# EasyEDA schematic SCH_IRRemote.json
TITLE: Sheet_1; REV: 1.0; Date: 2022-01-18; Sheet: 1/1; Drawn By: lingex; Company: Your Company
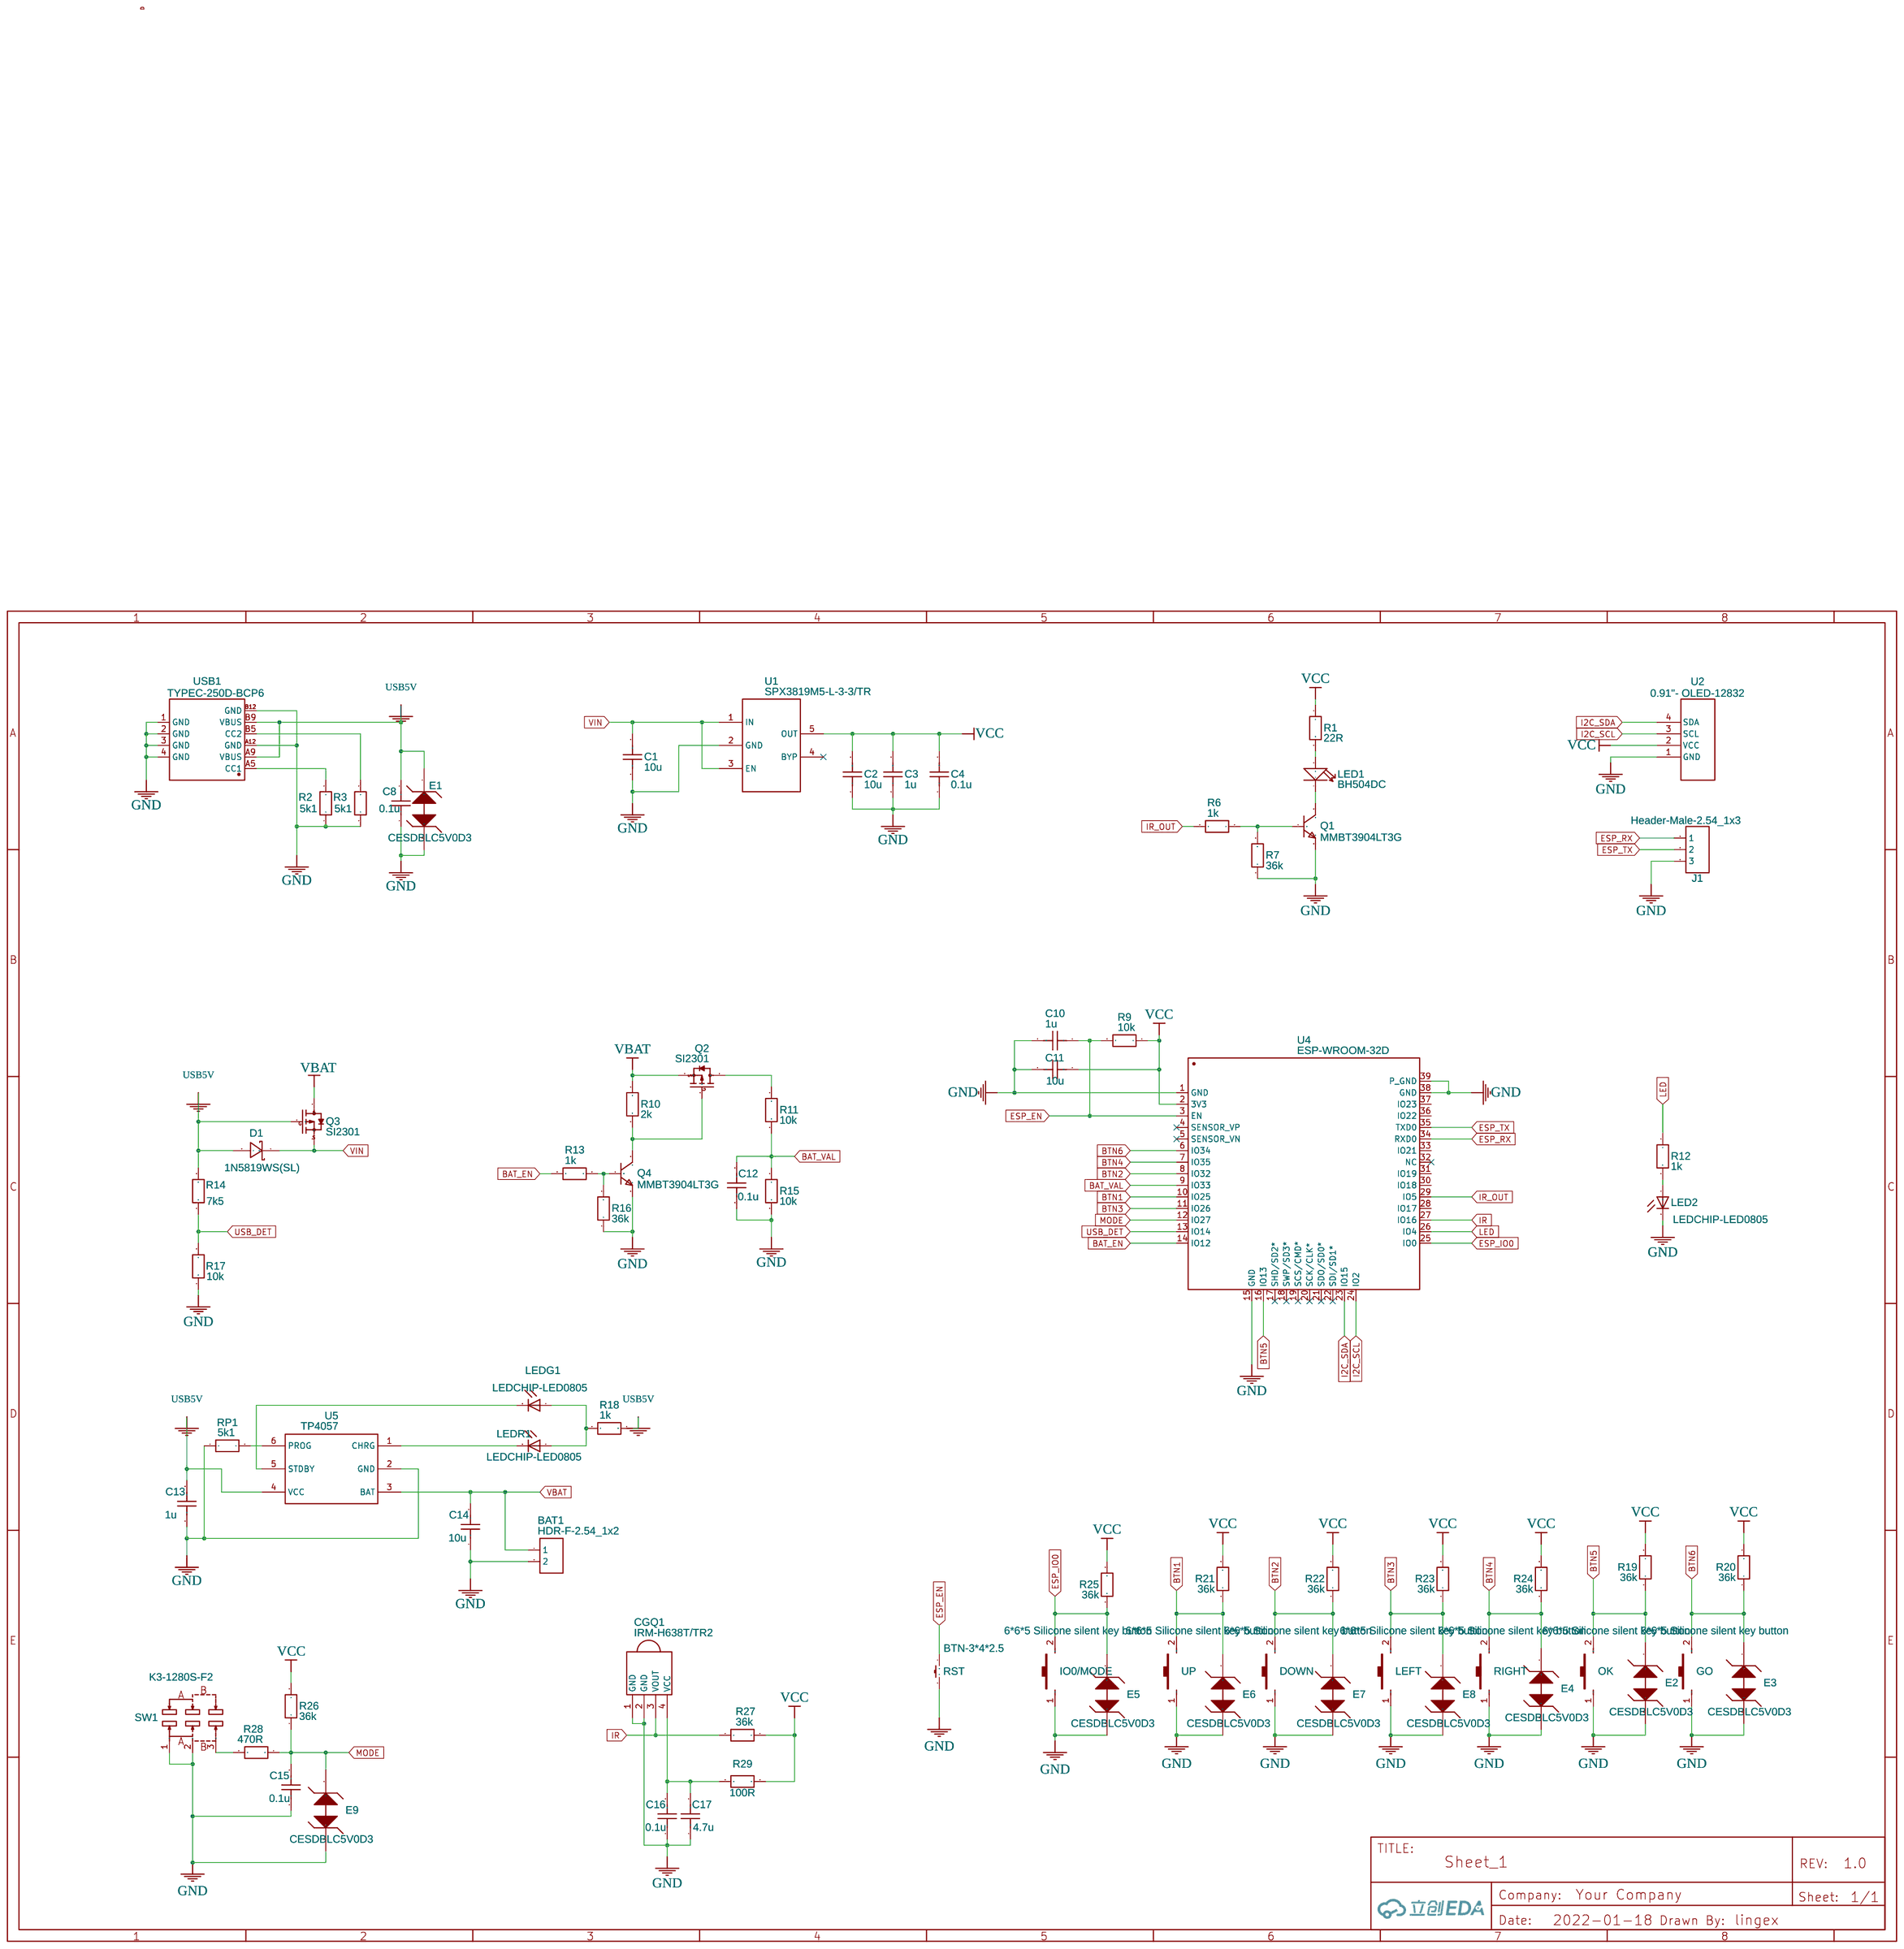
[diagram p0: schematic sheet]

## Parts
BAT1  HDR-F-2.54_1x2  [HDR-TH_2P-P2.54-V]
C1  10u  [C0603]
C2  10u  [C0603]
C3  1u  [C0603]
C4  0.1u  [C0603]
C8  0.1u  [C0603]
C10  1u  [C0603]
C11  10u  [C0603]
C12  0.1u  [C0603]
C13  1u  [C0805]
C14  10u  [C0805]
C15  0.1u  [C0603]
C16  0.1u  [C0603]
C17  4.7u  [C0603]
CGQ1  IRM-H638T/TR2  [SENSOR-SMD_IRM-H638T-TR2-TL]
D1  1N5819WS(SL)  [SOD-323_L1.8-W1.3-LS2.5-RD]
DOWN  6*6*5 Silicone silent key button  [KEY-SMD_L6.0-W6.0-LS6.6_C61120]
E1  CESDBLC5V0D3  [SOD-323_L1.8-W1.3-LS2.5-BI]
E2  CESDBLC5V0D3  [SOD-323_L1.8-W1.3-LS2.5-BI]
E3  CESDBLC5V0D3  [SOD-323_L1.8-W1.3-LS2.5-BI]
E4  CESDBLC5V0D3  [SOD-323_L1.8-W1.3-LS2.5-BI]
E5  CESDBLC5V0D3  [SOD-323_L1.8-W1.3-LS2.5-BI]
E6  CESDBLC5V0D3  [SOD-323_L1.8-W1.3-LS2.5-BI]
E7  CESDBLC5V0D3  [SOD-323_L1.8-W1.3-LS2.5-BI]
E8  CESDBLC5V0D3  [SOD-323_L1.8-W1.3-LS2.5-BI]
E9  CESDBLC5V0D3  [SOD-323_L1.8-W1.3-LS2.5-BI]
GO  6*6*5 Silicone silent key button  [KEY-SMD_L6.0-W6.0-LS6.6_C61120]
IO0/MODE  6*6*5 Silicone silent key button  [KEY-SMD_L6.0-W6.0-LS6.6_C61120]
J1  Header-Male-2.54_1x3  [HDR-TH_3P-P2.54-V-M-1]
LED1  BH504DC  [LED2-2.54-D5.0MM]
LED2  LEDCHIP-LED0805  [CHIP-LED0805]
LEDG1  LEDCHIP-LED0805  [CHIP-LED0805]
LEDR1  LEDCHIP-LED0805  [CHIP-LED0805]
LEFT  6*6*5 Silicone silent key button  [KEY-SMD_L6.0-W6.0-LS6.6_C61120]
OK  6*6*5 Silicone silent key button  [KEY-SMD_L6.0-W6.0-LS6.6_C61120]
Q1  MMBT3904LT3G  [SOT-23-3_L2.9-W1.3-P1.90-LS2.4-BR]
Q2  SI2301  [SOT-23-3_L2.9-W1.3-P1.90-LS2.4-BR]
Q3  SI2301  [SOT-23-3_L2.9-W1.3-P1.90-LS2.4-BR]
Q4  MMBT3904LT3G  [SOT-23-3_L2.9-W1.3-P1.90-LS2.4-BR]
R1  22R  [R0603]
R2  5k1  [R0603]
R3  5k1  [R0603]
R6  1k  [R0603]
R7  36k  [R0603]
R9  10k  [R0603]
R10  2k  [R0603]
R11  10k  [R0603]
R12  1k  [R0603]
R13  1k  [R0603]
R14  7k5  [R0603]
R15  10k  [R0603]
R16  36k  [R0603]
R17  10k  [R0603]
R18  1k  [R0603]
R19  36k  [R0603]
R20  36k  [R0603]
R21  36k  [R0603]
R22  36k  [R0603]
R23  36k  [R0603]
R24  36k  [R0603]
R25  36k  [R0603]
R26  36k  [R0603]
R27  36k  [R0603]
R28  470R  [R0603]
R29  100R  [R0603]
RIGHT  6*6*5 Silicone silent key button  [KEY-SMD_L6.0-W6.0-LS6.6_C61120]
RP1  5k1  [R0603]
RST  BTN-3*4*2.5  [3*4*2.5 贴片椭圆白头按钮开关]
SW1  K3-1280S-F2  [SW-SMD_K3-1280S-K1]
U1  SPX3819M5-L-3-3/TR  [SOT-23-5_L3.0-W1.7-P0.95-LS2.8-BR]
U2  0.91"- OLED-12832  [0.91 OLED-12832]
U4  ESP-WROOM-32D  [COMM-SMD_ESP-WROOM-32D]
U5  TP4057  [SOT-23-6_L2.9-W1.6-P0.95-LS2.8-BR]
UP  6*6*5 Silicone silent key button  [KEY-SMD_L6.0-W6.0-LS6.6_C61120]
USB1  TYPEC-250D-BCP6  [USB-C-SMD_TYPEC-250D-BCP6]

## Library data of the parts
BAT1 = HDR-F-2.54_1x2: Supplier Part: C49661; Supplier: LCSC; Contributor: LCEDA_Lib
C1-C4 C8 C10-C17 = C_0603_US: Contributor: LCEDA_Lib
CGQ1 = IRM-H638T/TR2: Supplier: LCSC; Manufacturer: EVERLIGHT; Supplier Part: C91447; JLCPCB Part Class: Extended Part
D1 = 1N5819WS(SL): Supplier: LCSC; Supplier Part: C489147; Manufacturer: KEXIN; Contributor: LCSC; JLCPCB Part Class: Extended Part
DOWN GO IO0/MODE LEFT OK RIGHT UP = 6*6*5 Silicone silent key button: Supplier Part: C61120; Supplier: LCSC; Manufacturer: ReliaPro
E1 = CESDBLC5V0D3: Supplier: LCSC; Manufacturer: CJ; image: //image.lceda.cn/szlcsc/C47346.jpg; Supplier Part: C47346; Paste Type: expand
E2-E9 = CESDBLC5V0D3: Supplier: LCSC; Manufacturer: CJ; image: //image.lceda.cn/szlcsc/C47346.jpg; Supplier Part: C47346; Paste Type: expand; JLCPCB Part Class: Extended Part
J1 = Header-Male-2.54_1x3: Supplier: LCSC; Manufacturer: BOOMELE; Manufacturer Part: Header2.54mm 1*3P; Supplier Part: C49257; JLCPCB Part Class: Extended Part
LED1 = BH504DC: DIP LED Blue-Blue-5mm;
LED2 LEDG1 LEDR1 = LEDCHIP-LED0805: LED; Contributor: Adafruit
Q1 Q4 = MMBT3904LT3G: Supplier: LCSC; Supplier Part: C150052; Manufacturer: ON Semicon; Contributor: LCSC; LCSC Assembly: Yes; SMT Type: Extend; JLCPCB Part Class: Extended Part
Q2 Q3 = SI2301: Supplier: LCSC; Manufacturer: Hottech; Contributor: LCSC; Supplier Part: C181086; JLCPCB Part Class: Extended Part
R1-R3 R6 R7 R9-R29 RP1 = R_0603_EU: Contributor: LCEDA_Lib
RST = 3*4*2.5 贴片椭圆白头按钮开关: Supplier: LCSC; Supplier Part: C493284; Manufacturer: USAKRO; Manufacturer Part: UK-B0267-ZT-SP25Y; Contributor: 黑色小河; link: https://item.taobao.com/item.htm?id=561404936316
SW1 = K3-1280S-F2: Supplier: LCSC; Manufacturer: HRO; Supplier Part: C92658; JLCPCB Part Class: Extended Part
U1 = SPX3819M5-L-3-3/TR: Supplier: LCSC; Manufacturer: EXAR; image: //image.lceda.cn/szlcsc/C9055.jpg; Supplier Part: C9055; Paste Type: recommend; JLCPCB Part Class: Extended Part
U2 = 0.91"- OLED-12832: sourceId: X2WQ82kCU; Supplier: SeeedStudio; Contributor: 起来学习了
U4 = ESP-WROOM-32D: Supplier: LCSC; Supplier Part: C2894836; JLCPCB Part Class: Extended Part; Contributor: LCSC
U5 = TP4057: Supplier: LCSC; Manufacturer: TOPPOWER; Supplier Part: C12044; JLCPCB Part Class: Basic Part
USB1 = TYPEC-250D-BCP6: Supplier: LCSC; Supplier Part: C720626; Manufacturer: XUNPU; Contributor: LCSC; JLCPCB Part Class: Extended Part

## Nets
GND: BAT1.2 C1.1 C2.1 C3.1 C4.1 C8.1 C10.2 C11.2 C12.2 C13.1 C14.1 C15.1 C16.1 C17.1 CGQ1.1(GND) CGQ1.2(GND) DOWN.1 E1.2 E2.2 E3.2 E4.2 E5.2 E6.2 E7.2 E8.2 E9.2 GO.1 IO0/MODE.1 J1.3 LED2.C LEFT.1 OK.1 Q1.2(E) Q4.2(E) R2.1 R3.1 R7.1 R15.2 R16.1 R17.1 RIGHT.1 RP1.1 RST.1 SW1.1 SW1.2 U1.2(GND) U2.1(GND) U4.1(GND) U4.15(GND) U4.38(GND) U4.39(P_GND) U5.2(GND) UP.1 USB1.1(GND) USB1.2(GND) USB1.3(GND) USB1.4(GND) USB1.A12(GND) USB1.B12(GND)
VBAT: BAT1.1 C14.2 Q2.2(S) Q3.3(D) R10.1 U5.3(BAT)
VCC: C2.2 C3.2 C4.2 C11.1 R1.1 R9.1 R19.2 R20.2 R21.2 R22.2 R23.2 R24.2 R25.2 R26.2 R27.2 R29.2 U1.5(OUT) U2.2(VCC) U4.2(3V3)
VIN: C1.2 D1.1(C) Q3.2(S) U1.1(IN) U1.3(EN)
BAT_EN: R13.2 U4.14(IO12)
BAT_VAL: C12.1 R11.2 R15.1 U4.9(IO33)
BTN1: E6.1 R21.1 U4.10(IO25) UP.2
BTN2: DOWN.2 E7.1 R22.1 U4.8(IO32)
BTN3: E8.1 LEFT.2 R23.1 U4.11(IO26)
BTN4: E4.1 R24.1 RIGHT.2 U4.7(IO35)
BTN5: E2.1 OK.2 R19.1 U4.16(IO13)
BTN6: E3.1 GO.2 R20.1 U4.6(IO34)
ESP_EN: C10.1 R9.2 RST.4(3) U4.3(EN)
ESP_IO0: E5.1 IO0/MODE.2 R25.1 U4.25(IO0)
ESP_RX: J1.1 U4.34(RXD0)
ESP_TX: J1.2 U4.35(TXD0)
I2C_SCL: U2.3(SCL) U4.24(IO2)
I2C_SDA: U2.4(SDA) U4.23(IO15)
IR: CGQ1.3(VOUT) R27.1 U4.27(IO16)
IR_OUT: R6.2 U4.29(IO5)
LED: R12.1 U4.26(IO4)
MODE: C15.2 E9.1 R26.1 R28.1 U4.12(IO27)
USB5V: C8.2 C13.2 D1.2(A) E1.1 Q3.1(G) R14.2 R18.2 U5.4(VCC) USB1.A9(VBUS) USB1.B9(VBUS)
USB_DET: R14.1 R17.2 U4.13(IO14)
Net-(C16-2): C16.2 C17.2 CGQ1.4(VCC) R29.1
Net-(LED1-+): LED1.+ R1.2
Net-(LED1--): LED1.- Q1.3(C)
Net-(LED2-A): LED2.A R12.2
Net-(LEDG1-A): LEDG1.A LEDR1.A R18.1
Net-(LEDG1-C): LEDG1.C U5.5(STDBY)
Net-(LEDR1-C): LEDR1.C U5.1(CHRG)
Net-(Q1-1): Q1.1(B) R6.1 R7.2
Net-(Q2-1): Q2.1(G) Q4.3(C) R10.2
Net-(Q2-3): Q2.3(D) R11.1
Net-(Q4-1): Q4.1(B) R13.1 R16.2
Net-(R2-2): R2.2 USB1.A5(CC1)
Net-(R3-2): R3.2 USB1.B5(CC2)
Net-(R28-2): R28.2 SW1.3
Net-(RP1-2): RP1.2 U5.6(PROG)

Not connected (* = marked no-connect by the designer): U1 4(BYP)*; U4 4(SENSOR_VP)* 5(SENSOR_VN)* 17(SHD/SD2*)* 18(SWP/SD3*)* 19(SCS/CMD*)* 20(SCK/CLK*)* 21(SDO/SD0*)* 22(SDI/SD1*)* 28(IO17) 30(IO18) 31(IO19) 32(NC)* 33(IO21) 36(IO22) 37(IO23)
